# EAGLE design LCD2USB (EAGLE 6.5.0)
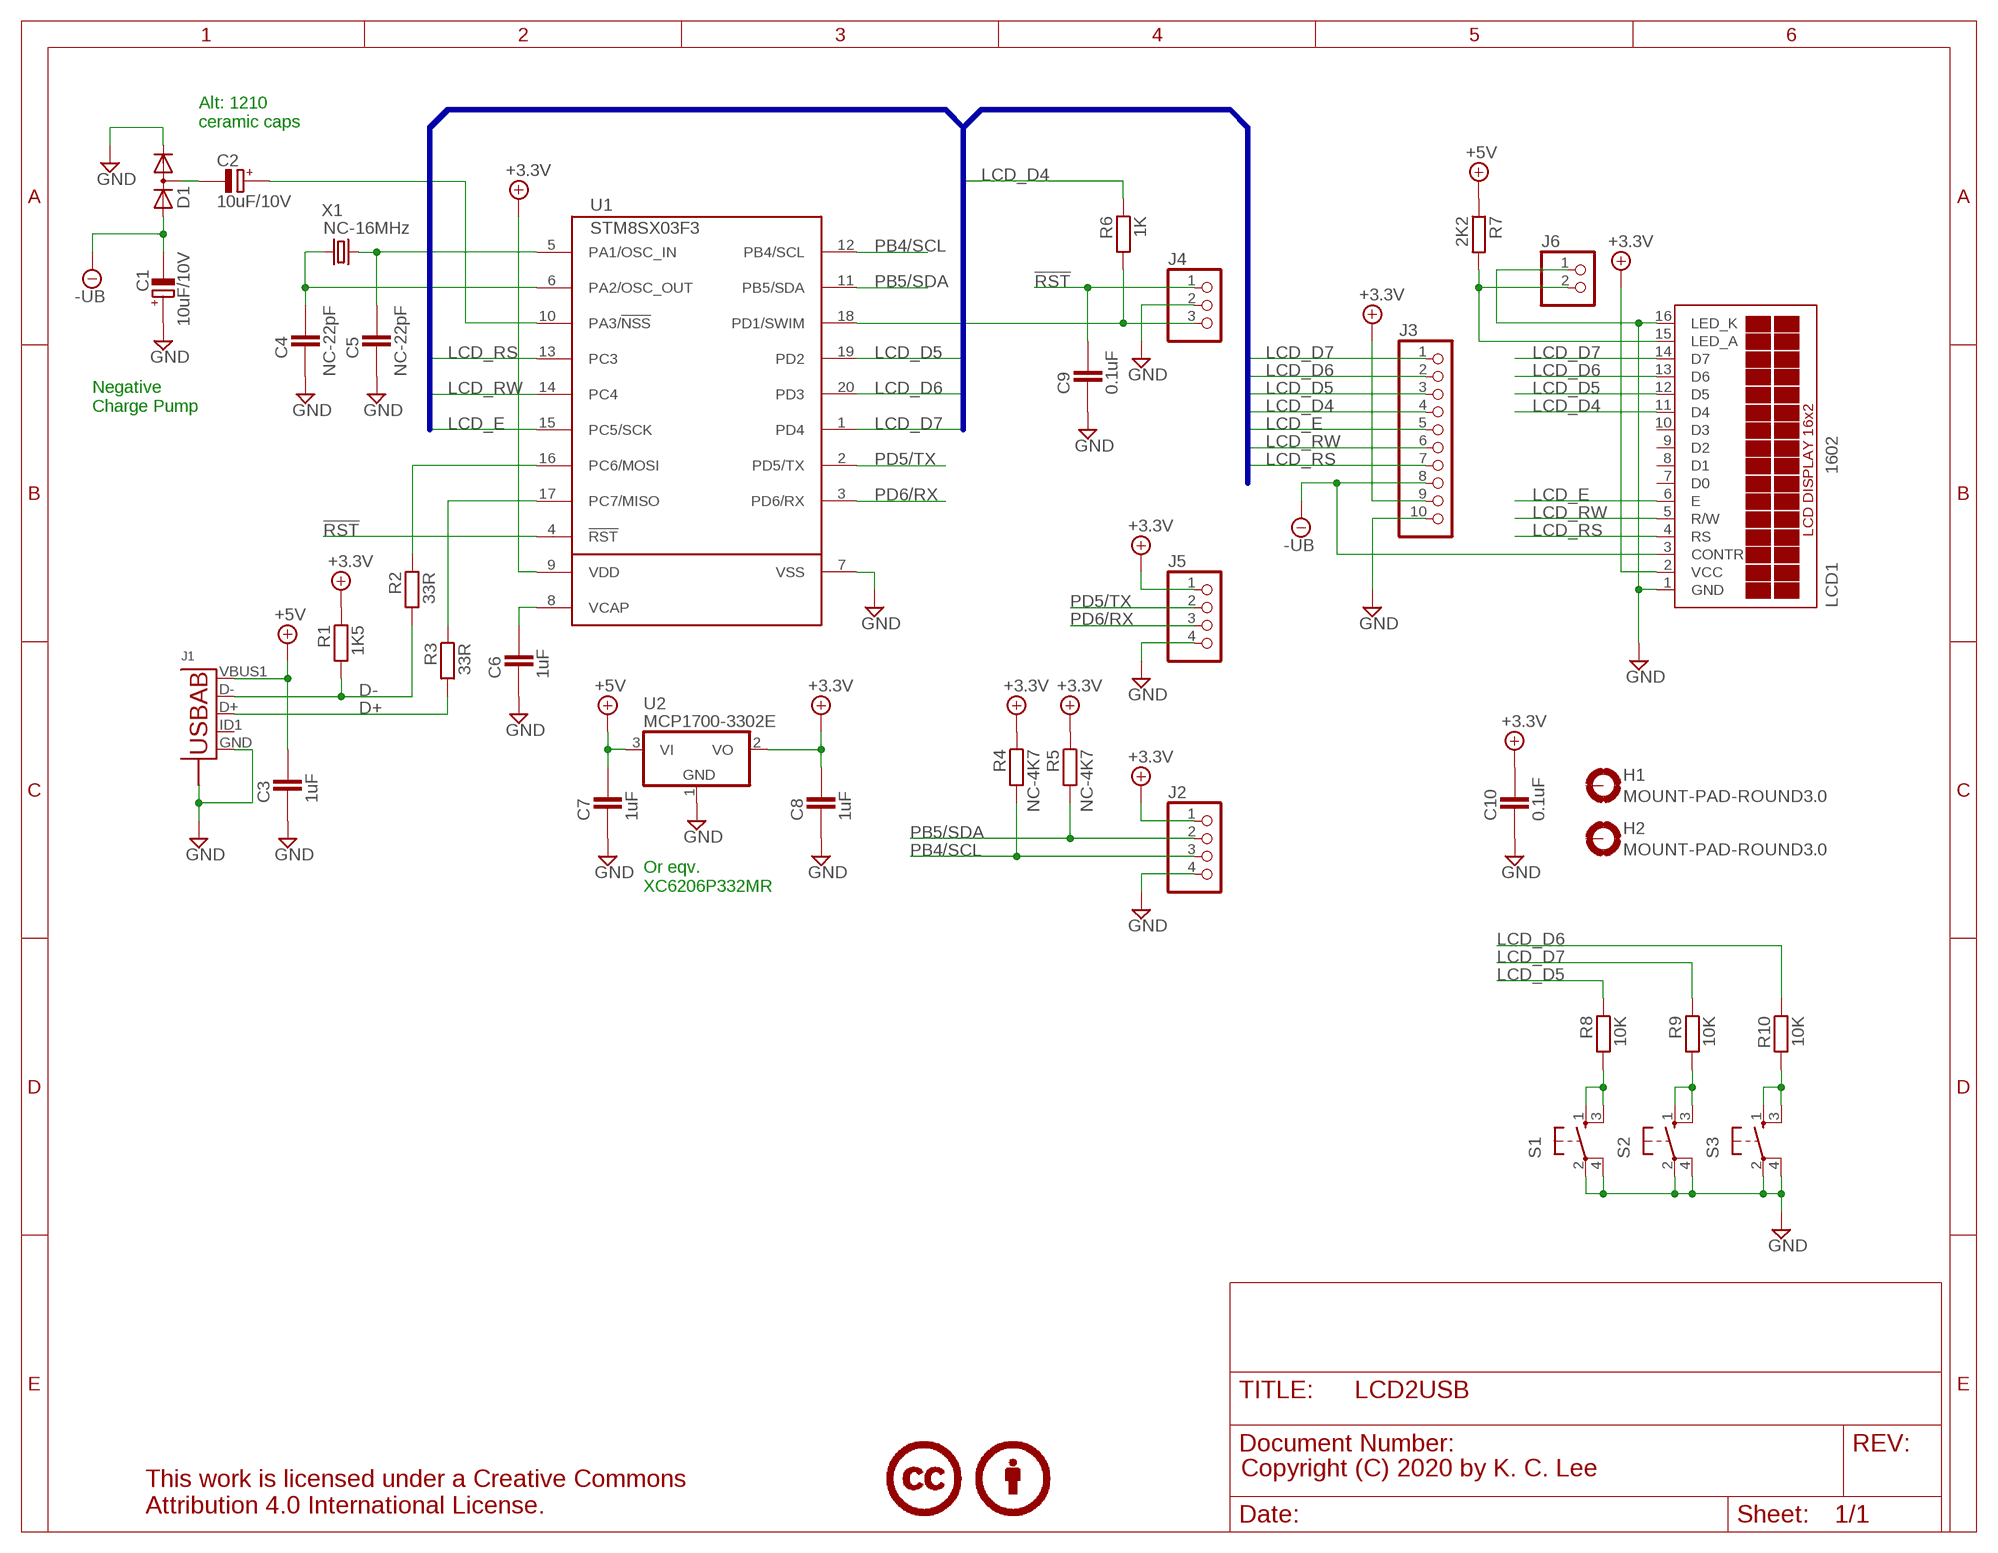
[diagram p0: schematic, sheet 1]

## Parts
C1  10uF/10V  POLARISED_B_CASE  [CAPMP3528X210N]
C2  10uF/10V  POLARISED_B_CASE  [CAPMP3528X210N]
C3  1uF  CAPACITOR_0603  [CAPC1608X92N]
C4  NC-22pF  CAPACITOR_0603  [CAPC1608X92N]
C5  NC-22pF  CAPACITOR_0603  [CAPC1608X92N]
C6  1uF  CAPACITOR_0603  [CAPC1608X92N]
C7  1uF  CAPACITOR_0603  [CAPC1608X92N]
C8  1uF  CAPACITOR_0603  [CAPC1608X92N]
C9  0.1uF  CAPACITOR_0603  [CAPC1608X92N]
C10  0.1uF  CAPACITOR_0603  [CAPC1608X92N]
D1  KA2KA_SOT-23  [SOT95P280X135-3N]
H1  MOUNT-PAD-ROUND3.0  [3,0-PAD]
H2  MOUNT-PAD-ROUND3.0  [3,0-PAD]
J1  USB-ABBG-ORG  [USB-AB-MICRO-SMD_V03_SMT]
J2  PINHD-1X4_2.54-90°  [1X04/90]
J3  PINHD-1X10_2.54  [1X10]
J4  PINHD-1X3_2.54-90°  [1X03/90]
J5  PINHD-1X4_2.54-90°  [1X04/90]
J6  PINHD-1X2_2.54  [1X02]
LCD1  1602  TUXGR_16X2_R2NOMOUNT  [TUXGR_16X2_R2_NM]
LICENSE1  CC-BY100%  [CC-BY-100]
R1  1K5  RESISTOR_0603  [RESC1608X55N]
R2  33R  RESISTOR_0805  [RESC2012X70N]
R3  33R  RESISTOR_0805  [RESC2012X70N]
R4  NC-4K7  RESISTOR_0603  [RESC1608X55N]
R5  NC-4K7  RESISTOR_0603  [RESC1608X55N]
R6  1K  RESISTOR_0603  [RESC1608X55N]
R7  2K2  RESISTOR_0603  [RESC1608X55N]
R8  10K  RESISTOR_0805  [RESC2012X70N]
R9  10K  RESISTOR_0805  [RESC2012X70N]
R10  10K  RESISTOR_0805  [RESC2012X70N]
S1  MOM_SWTH  [MOM_SW]
S2  MOM_SWTH  [MOM_SW]
S3  MOM_SWTH  [MOM_SW]
U1  STM8SX03F3  [TSSOP20]
U2  MCP1700-3302E  MCP1700/TT  [SOT95P280X135-3N]
X1  NC-16MHz  CRYSTALTC26H  [TC26H]

## Nets
!RST: C9.2 J4.1 U1.4(!RST)
+3.3V: C8.2 C10.2 J2.1 J3.9 J5.1 LCD1.2(VCC) R1.1 R4.1 R5.1 U1.9(VDD) U2.2(VO)
+5V: C3.2 C7.2 J1.VBUS1(VBUS) R7.1 U2.3(VI)
-UB: C1.- D1.1(A) J3.8 LCD1.3(CONTR)
D+: J1.D+ R3.2
D-: J1.D- R1.2 R2.2
GND: C1.+ C3.1 C4.1 C5.1 C6.1 C7.1 C8.1 C9.1 C10.1 D1.2(K) J1.GND J1.S1(S) J1.S2(S) J1.S3(S) J1.S4(S) J2.4 J3.10 J4.2 J5.4 J6.1 LCD1.1(GND) LCD1.16(LED_K) S1.2 S1.4 S2.2 S2.4 S3.2 S3.4 U1.7(VSS) U2.1(GND)
LCD_A: J6.2 LCD1.15(LED_A) R7.2
LCD_D4: J3.4 LCD1.11(D4) R6.1
LCD_D5: J3.3 LCD1.12(D5) R8.1 U1.19(PD2)
LCD_D6: J3.2 LCD1.13(D6) R10.1 U1.20(PD3)
LCD_D7: J3.1 LCD1.14(D7) R9.1 U1.1(PD4)
LCD_E: J3.5 LCD1.6(E) U1.15(PC5/SCK)
LCD_RS: J3.7 LCD1.4(RS) U1.13(PC3)
LCD_RW: J3.6 LCD1.5(R/W) U1.14(PC4)
N$2: C6.2 U1.8(VCAP)
N$3: R3.1 U1.17(PC7/MISO)
N$4: C5.2 U1.5(PA1/OSC_IN) X1.1
N$5: C4.2 U1.6(PA2/OSC_OUT) X1.2
N$7: R2.1 U1.16(PC6/MOSI)
N$9: R8.2 S1.1 S1.3
N$11: C2.+ U1.10(PA3/!NSS)
N$12: C2.- D1.3(KA)
N$16: J4.3 R6.2 U1.18(PD1/SWIM)
N$18: R9.2 S2.1 S2.3
N$19: R10.2 S3.1 S3.3
PB4/SCL: J2.3 R4.2 U1.12(PB4/SCL)
PB5/SDA: J2.2 R5.2 U1.11(PB5/SDA)
PD5/TX: J5.2 U1.2(PD5/TX)
PD6/RX: J5.3 U1.3(PD6/RX)
Unconnected: H1.B3,0(MOUNT) H2.B3,0(MOUNT) J1.ID1(USBID) LCD1.7(D0) LCD1.8(D1) LCD1.9(D2) LCD1.10(D3)

## Buses
B$1

## Notes on the sheet
- Alt: 1210
  ceramic caps
- Negative
  Charge Pump
- Or eqv. 
  XC6206P332MR
- Copyright (C) 2020 by K. C. Lee

## Library data of the parts
C1 C2 = ipc-7351-capacitor:POLARISED_
C3-C10 = ipc-7351-capacitor:CAPACITOR_
D1 = ipc-7351-diode:KA2KA_
H1 H2 = holes:MOUNT-PAD-ROUND: MOUNTING PAD, round
J1 = Misc Conn:USB-AB: This is a USB AB connector that is compatible with USB OTG. i.e. this connector can serve as a host or device
J2 J5 = pinhead-1:PINHD-1X4: PIN HEADER
J3 = pinhead-1:PINHD-1X10: PIN HEADER
J4 = pinhead-1:PINHD-1X3: PIN HEADER
J6 = pinhead-1:PINHD-1X2: PIN HEADER
LCD1 = Misc opto:TUXGR_16X2_R2: Tuxgraphics LCD display 16x2 characters reflective, without background light Source: tuxgr_12x2_r2.pdf; OC_FARNELL: unknown; OC_NEWARK: unknown
LICENSE1 = Misc logo:CC-BY
R1-R10 = ipc-7351-resistor:RESISTOR_
S1-S3 = Misc Passives:MOM_SW: Tact Switch
U1 = Misc Processor:STM8SX03F
U2 = Misc Power:MCP1700
X1 = crystal:CRYSTAL: CRYSTAL; OC_FARNELL: unknown; OC_NEWARK: unknown

## Board
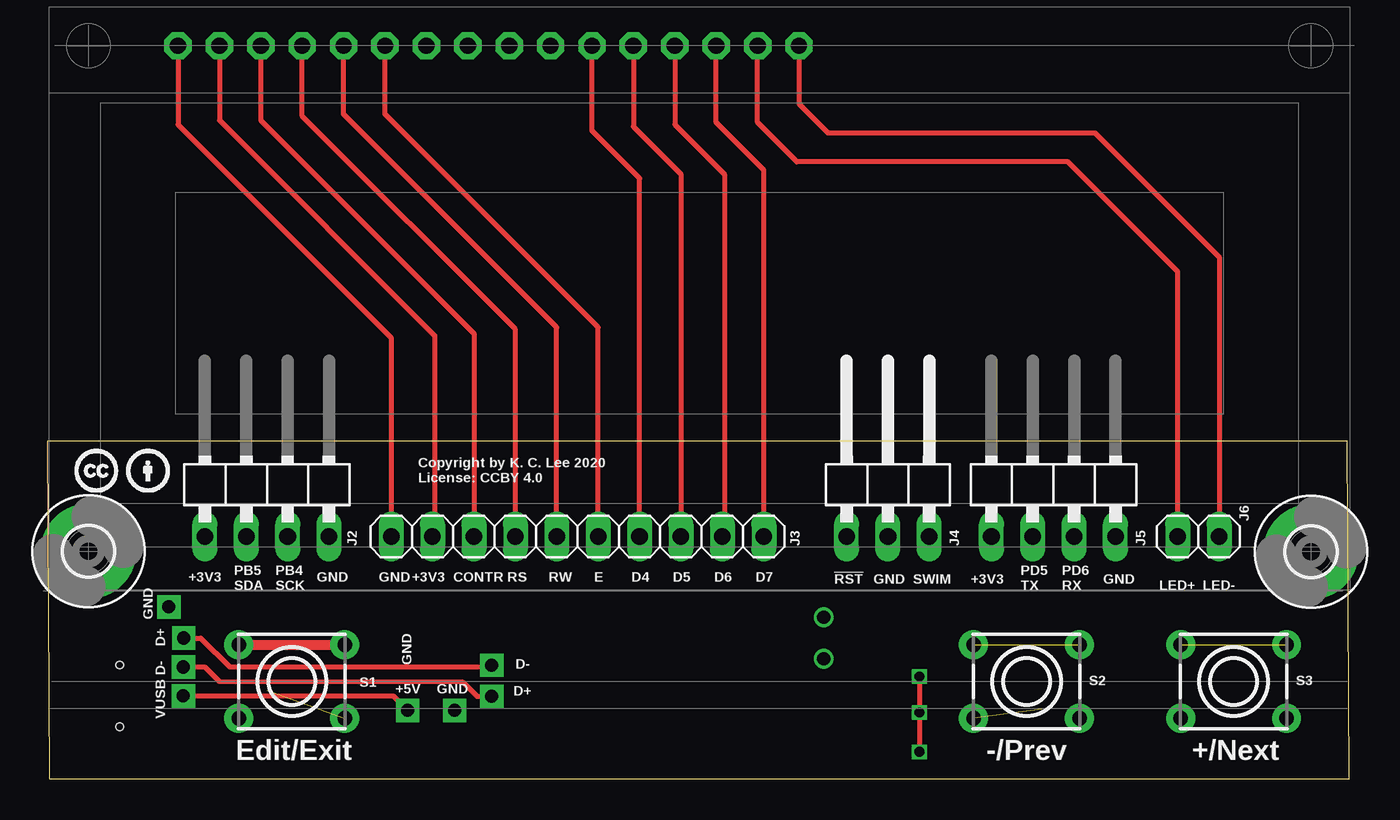
[diagram p1: board, top side]
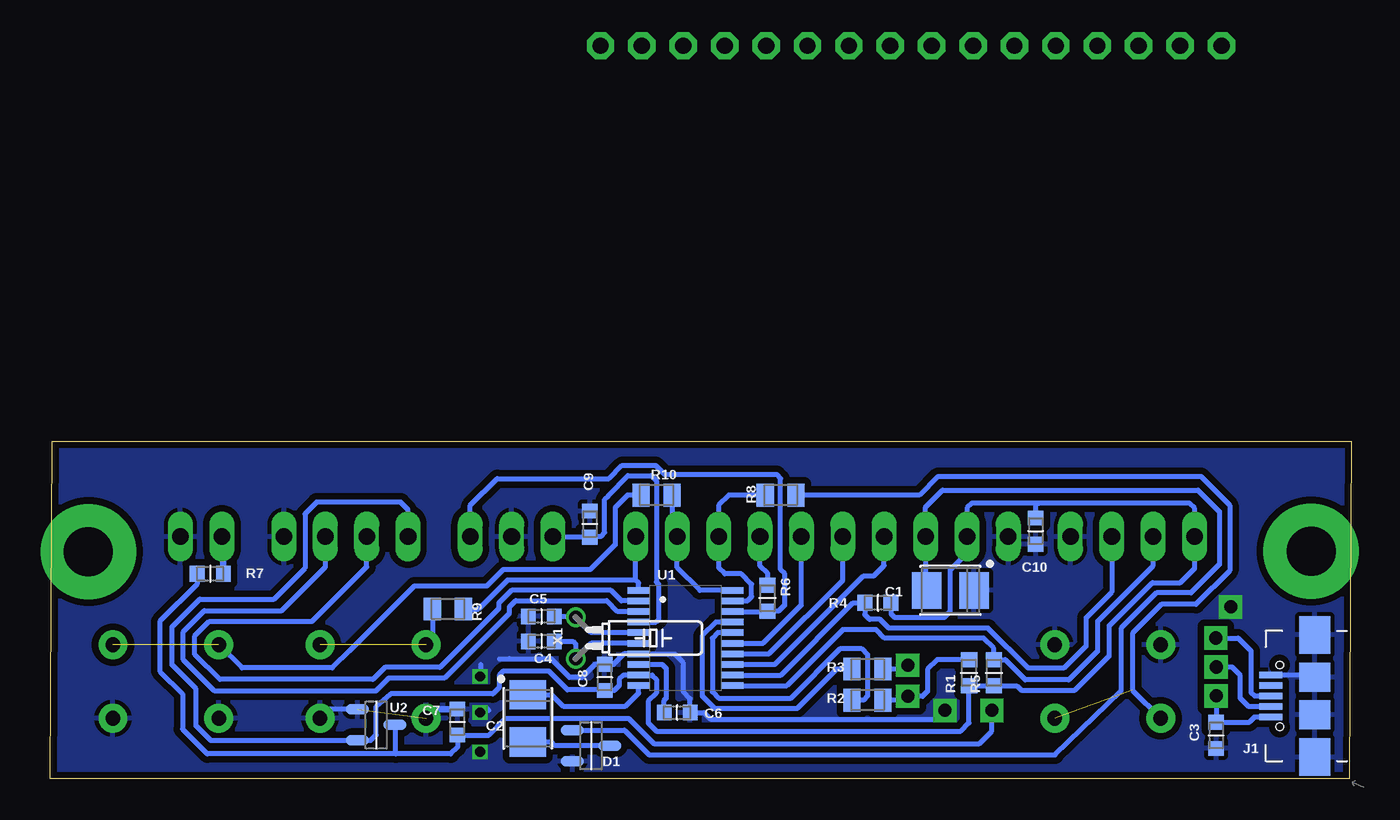
[diagram p2: board, bottom side, seen from below]

Size 79.88 x 20.7 mm. Coordinates in mm from the lower left corner, seen from the top.
Outline: 0.13,0 79.88,0 79.76,20.7 0,20.7 0.13,0
Copper layers (1*16): Top 0.035559375mm / dielectric 1.6mm / Bottom 0.035559375mm
Design rules "oshpark-2layer-tented-vias": minimum track width 6mil, minimum drill 10mil, track to track 6mil, track to pad 6mil, pad to pad 6mil, via to via 6mil, smd to smd 6mil, copper to edge 15mil, drill to drill 6mil, minimum pad ring 5mil, minimum via ring 5mil, stop-mask expansion 2.5mil, vias tented up to drill 13mil, thermal gap 10mil

### Footprints (pad centres in the part's own frame; a part is rotated, then mirrored left to right if it is on the bottom)
CAPMP3528X210N = smd 1.8 x 2.25: + -1.45,0; - 1.45,0
CAPC1608X92N = smd 0.9 x 0.95: 1 -0.8,0; 2 0.8,0
SOT95P280X135-3N = smd 1.4 x 0.65: 1 -1.15,0.95; 2 -1.15,-0.95; 3 1.15,0
3,0-PAD = drill 3 pad 5.842: B3,0 0,0
USB-AB-MICRO-SMD_V03_SMT = smd 1.4 x 0.4: D+ 2.7,0; D- 2.7,0.65; GND 2.7,-1.3; ID1 2.7,-0.65; VBUS1 2.7,1.3 | smd 1.9 x 2.3: S1 0,3.75; S4 0,-3.75 | smd 1.9 x 1.8: S2 0,1.15; S3 0,-1.15 | hole 0.45: 2.15,1.9; 2.15,-1.9
1X04/90 = drill 1.016 long: 1 -3.81,-3.81; 2 -1.27,-3.81; 3 1.27,-3.81; 4 3.81,-3.81
1X10 = drill 1.016 long: 1 -11.43,0; 2 -8.89,0; 3 -6.35,0; 4 -3.81,0; 5 -1.27,0; 6 1.27,0; 7 3.81,0; 8 6.35,0; 9 8.89,0; 10 11.43,0
1X03/90 = drill 1.016 long: 1 -2.54,-3.81; 2 0,-3.81; 3 2.54,-3.81
1X02 = drill 1.016 long: 1 -1.27,0; 2 1.27,0
TUXGR_16X2_R2_NM = drill 1 pad 1.676 octagon: 1 -32,15.5; 2 -29.46,15.5; 3 -26.92,15.5; 4 -24.38,15.5; 5 -21.84,15.5; 6 -19.3,15.5; 7 -16.76,15.5; 8 -14.22,15.5; 9 -11.68,15.5; 10 -9.14,15.5; 11 -6.6,15.5; 12 -4.06,15.5; 13 -1.52,15.5; 14 1.02,15.5; 15 3.56,15.5; 16 6.1,15.5
RESC1608X55N = smd 0.9 x 1: 1 -0.8,0; 2 0.8,0
RESC2012X70N = smd 1.05 x 1.4: 1 -0.95,0; 2 0.95,0
MOM_SW = drill 0.9 pad 1.778: 1 -2.25,3.25; 2 2.25,3.25; 3 -2.25,-3.25; 4 2.25,-3.25
TSSOP20 = smd 0.4 x 1.35: 1 -2.925,-2.875; 2 -2.275,-2.875; 3 -1.625,-2.875; 4 -0.975,-2.875; 5 -0.325,-2.875; 6 0.325,-2.875; 7 0.975,-2.875; 8 1.625,-2.875; 9 2.275,-2.875; 10 2.925,-2.875; 11 2.925,2.875; 12 2.275,2.875; 13 1.625,2.875; 14 0.975,2.875; 15 0.325,2.875; 16 -0.325,2.875; 17 -0.975,2.875; 18 -1.625,2.875; 19 -2.275,2.875; 20 -2.925,2.875
TC26H = drill 0.813: 1 -1.27,0; 2 1.27,0

### Placement (x,y rotation side)
C1  24.64,11.56 180 bottom
C2  50.57,3.71 270 bottom
C3  8.33,2.67 90 bottom
C4  49.73,8.43 0 bottom
C5  49.73,9.96 0 bottom
C6  41.4,4.06 180 bottom
C7  54.89,3.48 270 bottom
C8  45.85,6.22 270 bottom
C9  46.76,15.62 270 bottom
C10  19.41,15.19 90 bottom
D1  46.69,2.03 0 bottom
H1  2.5,13.96 0 top
H2  77.53,13.93 0 top
J1  2.29,5.08 180 bottom
J2  13.46,18.67 0 top
J3  32.51,14.86 180 top
J4  51.56,18.67 0 top
J5  61.72,18.67 0 top
J6  70.61,14.86 180 top
LCD1  40.01,29.46 0 top  (outside the outline)
LICENSE1  1.65,17.53 0 top
R1  23.49,6.5 90 bottom
R2  29.72,4.83 0 bottom
R3  29.72,6.73 0 bottom
R4  29.08,10.79 180 bottom
R5  21.97,6.5 90 bottom
R6  35.86,11.07 270 bottom
R7  70.05,12.57 0 bottom
R8  35.05,17.4 0 bottom
R9  55.47,10.41 180 bottom
R10  42.67,17.4 180 bottom
S1  14.99,5.97 90 top
S2  60.07,5.97 270 top
S3  72.77,5.97 270 top
U1  40.89,8.64 270 bottom
U2  59.87,3.3 0 bottom
X1  47.62,8.64 270 bottom

### Tracks (layer width: path | path; a pad name or v marks a point on that pad's centre or on a via)
!RST
  Bottom 0.305: U1.4 42.71,9.61 42.55,9.78 42.55,11.94 42.67,12.06 42.67,18.29 42.98,18.59 44.43,18.59 45.62,17.37 45.85,17.14 45.85,15.11 46.1,14.86 46.98,14.86 C9.2 48.98,14.82 J4.1
+3.3V
  Top 0.305: LCD1.2 10.54,40.38 23.75,27.18 23.75,14.99 J3.9
  Bottom 0.305: 19.18,16.92 9.98,16.92 9.65,16.59 J2.1 9.65,12.9 10.52,12.04 12.24,12.04 14.88,9.4 14.88,7.54 16.99,5.44 20.29,5.44 20.56,5.7 R5.1 R1.1 23.49,3.43 24,2.92 42.67,2.92 43.18,3.43 43.18,4.75 42.67,5.26 42.67,6.1 42.94,6.36 U1.9 44.69,6.36 44.96,6.1 44.96,5.71 45.25,5.42 C8.2 46.01,5.46 48.13,5.46 49.28,6.6 52.07,6.6 52.32,6.35 52.32,5.59 52.71,5.21 58.98,5.21 59.87,4.45 59.87,2.69 60.21,2.35 U2.2 61.03,2.34 70,2.34 70.92,3.25 70.92,5.51 72.39,6.99 72.39,9.32 70.69,11.02 66.14,11.02 64.24,12.93 64.24,16.26 63.53,16.97 58.37,16.97 57.91,16.51 J5.1 | 19.18,16.92 23.32,16.92 23.62,16.61 J3.9 23.62,13.84 24.64,12.83 24.64,10.29 25.02,9.91 28.07,9.91 28.28,10.12 R4.1 | C10.2 19.41,16.89 19.18,16.92
+5V  (via drill 0.8 pad 1.42)
  Top 0.305: v8.33,5.08 21.21,5.08 v22.1,4.19
  Bottom 0.305: 58.67,1.52 55.3,1.52 54.89,1.93 C7.2 52.95,2.68 51.92,3.71 44.37,3.71 42.82,2.16 22.86,2.16 22.1,2.92 v22.1,4.19 | 58.67,1.52 70.23,1.52 71.75,3.05 71.75,5.21 73.15,6.6 73.15,9.65 70.87,11.94 R7.1 | U2.3 58.72,1.57 58.67,1.52 | J1.VBUS1 6,3.78 6.31,3.47 C3.2 v8.33,5.08
-UB
  Top 0.305: LCD1.3 13.09,40.38 26.16,27.3 J3.8
  Bottom 0.305: C1.- 26.16,11.23 J3.8 26.16,16.66 25.12,17.7 9.45,17.7 8.13,16.38 8.13,13.16 9.88,11.4 11.99,11.4 14.17,9.22 14.17,5.38 18.21,1.47 43.13,1.47 44.64,2.98 D1.1
D+  (via drill 0.8 pad 1.42)
  Top 0.305: v8.36,8.64 9.4,8.64 11.18,6.86 27.15,6.86 v27.25,6.96
  Bottom 0.305: J1.D+ 5.97,5.08 6.2,5.31 6.2,7.85 6.98,8.64 v8.36,8.64 | v27.25,6.96 27.53,6.96 27.76,6.73 R3.2
D-  (via drill 0.8 pad 1.42)
  Top 0.305: v8.33,6.86 9.65,6.86 10.54,5.97 25.45,5.94 26.34,5.05 v27.25,5.05
  Bottom 0.305: J1.D- 6.33,4.43 6.86,4.95 6.86,6.35 7.37,6.86 v8.33,6.86 | R2.2 27.81,4.83 27.58,5.05 v27.25,5.05 26.34,5.05 26.04,5.36 26.04,6.71 25.44,7.3 R1.2
GND  (via drill 0.6, 0.8 pad 1.42)  (1 unrouted)
  Top 0.305: v53.49,6.27 v53.49,4.06 v53.49,1.65 | LCD1.16 46.11,41.4 47.88,39.62 64.26,39.62 71.88,32 J6.1 | LCD1.1 8.01,40.13 21.08,27.05 J3.10
  Top 0.61: S1.2 S1.4
  Bottom 0.305: J1.GND 2.44,6.38 J1.S3 | 52.31,7.35 51.69,7.37 49.15,7.37 48.01,6.22 47.24,6.22 46.44,7.02 C8.1 45.3,7.02 44.66,7.66 U1.7 41.57,7.66 41.02,7.11 41.02,5.33 40.6,4.92 C6.1 39.75,4.06 39.35,3.66 25.58,3.66 v24.97,4.19 | 53.45,7 v53.49,6.27 | v53.49,4.06 52.96,4.19 53.09,4.32 | U2.1 62.78,4.25 63.32,3.71
  Bottom 0.406: 2.29,6.38 J1.S3 | S2.4 56.73,3.72 56.17,4.28 C7.1
  other vias: 7.44,10.54
  pour Bottom (isolate 0.406, rank 6): 0.13,0 79.76,0 79.76,33.66 0.38,33.66
LCD_A
  Top 0.305: J6.2 69.34,31.11 62.61,37.85 45.97,37.85 43.56,40.26 LCD1.15
  Bottom 0.406: R7.2 69.25,14.77 J6.2
LCD_D4
  Top 0.305: J3.4 36.32,36.83 33.4,39.75 LCD1.11
  Bottom 0.305: R6.1 35.87,12.62 36.32,13.08 J3.4
LCD_D5
  Top 0.305: LCD1.12 35.95,40 38.86,37.08 J3.3
  Bottom 0.305: U1.19 37.1,10.91 36.83,11.18 36.83,11.94 37.47,12.57 38.48,12.57 38.86,12.95 J3.3 38.86,16.76 38.23,17.4 R8.1
LCD_D6
  Top 0.305: LCD1.13 38.48,40.13 41.53,37.08 41.53,14.99 J3.2
  Bottom 0.305: U1.20 40.01,11.56 41.4,12.95 J3.2 41.72,15.18 R10.1
LCD_D7
  Top 0.305: J3.1 43.94,37.34 41.02,40.26 LCD1.14
  Bottom 0.305: U1.1 43.77,12.02 43.94,12.19 | 43.94,12.19 J3.1 | 43.94,12.19 51.82,12.19 53.59,10.41 R9.1
LCD_E
  Top 0.305: J3.5 33.78,27.69 20.7,40.77 LCD1.6
  Bottom 0.305: J3.5 33.78,10.67 36.14,8.31 U1.15
LCD_RS
  Top 0.305: J3.7 28.7,27.56 15.62,40.64 LCD1.4
  Bottom 0.305: U1.13 35.41,7.01 29.97,12.45 29.34,12.45 28.7,13.08 J3.7
LCD_RW
  Top 0.305: J3.6 31.24,27.69 18.16,40.77 LCD1.5
  Bottom 0.305: U1.14 35.77,7.66 31.24,12.19 J3.6
N$2
  Bottom 0.305: U1.8 42.32,7.01 42.08,6.77 42.08,4.94 42.2,4.81 C6.2
N$3
  Bottom 0.305: U1.17 39.03,9.61 39.88,8.76 39.88,5.08 39.12,4.32 34.04,4.32 31.62,6.73 R3.1
N$4
  Bottom 0.305: U1.5 46.68,8.96 X1.1 47.68,9.96 C5.2
N$5
  Bottom 0.305: U1.6 46.68,8.31 X1.2 47.62,8.26 47.8,8.43 C4.2
N$7
  Bottom 0.305: U1.16 38.92,8.96 39.24,8.64 39.24,5.33 38.86,4.95 34.42,4.95 31.37,8 30.1,8 29.72,7.62 29.72,5.08 29.97,4.83 R2.1
N$9  (1 unrouted)
  Bottom 0.305: R8.2 26.54,17.4 25.4,18.54 9.27,18.54 7.49,16.76 7.49,12.78 9.58,10.69 11.68,10.69 13.46,8.91 13.46,5.45 S1.1
N$11
  Bottom 0.305: U1.10 43.76,5.26 44.6,4.42 48.36,4.42 49.1,5.16 C2.+
N$12
  Bottom 0.305: D1.3 48.9,2.03 49.12,2.26 C2.-
N$16
  Bottom 0.305: U1.18 R6.2 35.8,10.29 35.18,10.29 34.8,10.67 34.8,12.57 35.05,12.83 35.05,18.41 35.31,18.67 42.16,18.67 42.72,19.23 44.78,19.23 45.59,18.41 52.45,18.41 54.1,16.76 J4.3
N$18  (1 unrouted)
  Bottom 0.305: R9.2 56.42,8.62 S2.3
N$19  (1 unrouted)
  Bottom 0.305: R10.2 44.45,17.4 45.21,16.64 45.21,14.35 46.74,12.83 52.07,12.83 53.09,11.81 57.53,11.81 61.47,7.87 62.56,6.8 68.1,6.8 S3.3
PB4/SCL
  Bottom 0.305: U1.12 35.04,6.36 30.61,10.79 R4.2 29.88,10.07 29.59,9.78 28.96,9.78 28.42,9.25 22.33,9.25 19.86,6.78 17.68,6.78 16.31,8.15 16.31,9.88 14.73,11.46 J2.3
PB5/SDA
  Bottom 0.305: U1.11 34.68,5.71 31.24,9.14 29.18,9.14 28.68,8.64 22.61,8.64 21.97,8 R5.2 21.27,7.3 20.04,6.07 17.37,6.07 15.6,7.85 15.6,9.68 12.19,13.08 J2.2
PD5/TX
  Bottom 0.305: U1.2 44.82,10.91 45.47,11.56 51.56,11.56 52.35,10.77 52.35,10.44 55.96,6.83 59.33,6.83 60.07,6.1 69.47,6.1 70.99,7.62 70.99,8.76 70.1,9.65 63.8,9.65 60.45,13.01 J5.2
PD6/RX
  Bottom 0.305: U1.3 45.06,10.26 45.72,10.92 51.31,10.92 51.69,10.54 51.69,10.16 55.68,6.17 59.11,6.17 59.89,5.38 69.77,5.38 71.7,7.32 71.7,9.02 70.41,10.31 65.66,10.31 62.99,12.98 J5.3

### Text on the board
tPlace: Copyright by K. C. Lee 2020 / License: CCBY 4.0 | +3V3 | PB5 / SDA | PB4 / SCK | GND | GND | +3V3 | CONTR | RS | RW | E | D4 | D5 | D6 | D7 | !RST | GND | SWIM | +3V3 | PD5 / TX | PD6 / RX | GND | LED+ | LED- | GND | D+ | GND | D- | D- | +5V | GND | D+ | VUSB | Edit/Exit | -/Prev | +/Next